# Altium schematic sheet STM32F103_扩展板.SchDoc
size A4; SheetNumber: 1; SheetTotal: 4
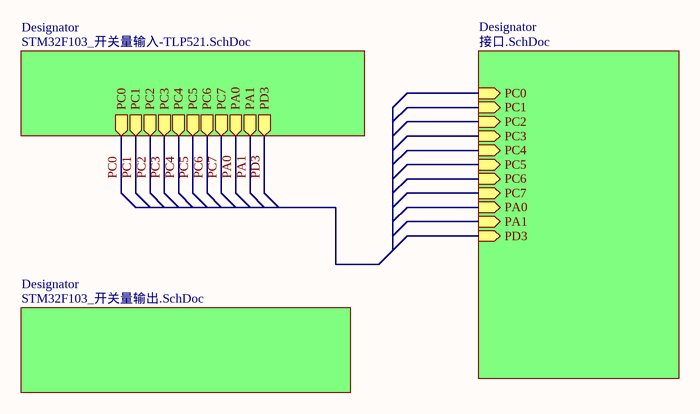
[diagram p0: STM32F103_扩展板.SchDoc]

## Sub-sheets
Designator = STM32F103_开关量输入-TLP521.SchDoc: PC0 (out), PC1 (out), PC2 (out), PC3 (out), PC4 (out), PC5 (out), PC6 (out), PC7 (out), PA0 (out), PA1 (out), PD3 (out)
Designator = STM32F103_开关量输出.SchDoc: no entries
Designator = 接口.SchDoc: PC0 (in), PC1 (in), PC2 (in), PC3 (in), PC4 (in), PC5 (in), PC6 (in), PC7 (in), PA0 (in), PA1 (in), PD3 (in)

## Nets
PA0: sheet Designator/PA0
PA1: sheet Designator/PA1
PC0: sheet Designator/PC0
PC1: sheet Designator/PC1
PC2: sheet Designator/PC2
PC3: sheet Designator/PC3
PC4: sheet Designator/PC4
PC5: sheet Designator/PC5
PC6: sheet Designator/PC6
PC7: sheet Designator/PC7
PD3: sheet Designator/PD3